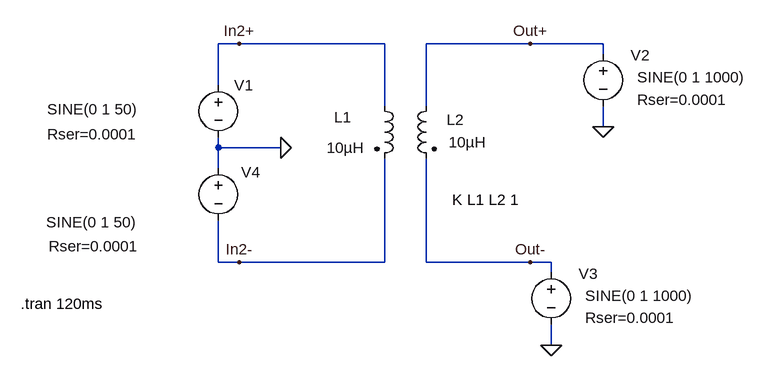
[diagram p0: schematic AC Power Flow ver 1.3.asc]
AC Power Flow ver 1.3.asc, the LTspice schematic file:
Version 4
SHEET 1 880 680
WIRE -704 -96 -736 -96
WIRE -480 -96 -704 -96
WIRE -256 -96 -416 -96
WIRE -144 -96 -256 -96
WIRE -144 -80 -144 -96
WIRE -736 -32 -736 -96
WIRE -480 0 -480 -96
WIRE -416 0 -416 -96
WIRE -144 32 -144 0
WIRE -736 64 -736 48
WIRE -640 64 -736 64
WIRE -736 96 -736 64
WIRE -736 240 -736 176
WIRE -704 240 -736 240
WIRE -480 240 -480 80
WIRE -480 240 -704 240
WIRE -416 240 -416 80
WIRE -256 240 -416 240
WIRE -224 240 -256 240
WIRE -224 256 -224 240
WIRE -224 368 -224 336
FLAG -640 64 0
FLAG -704 -96 In2+
FLAG -704 240 In2-
FLAG -256 -96 Out+
FLAG -256 240 Out-
FLAG -144 32 0
FLAG -224 368 0
SYMBOL voltage -736 -48 R0
WINDOW 3 -263 53 Left 2
WINDOW 123 0 0 Left 2
WINDOW 39 -263 91 Left 2
SYMATTR Value SINE(0 1 50)
SYMATTR SpiceLine Rser=0.0001
SYMATTR InstName V1
SYMBOL voltage -736 80 R0
WINDOW 0 35 22 Left 2
WINDOW 3 -265 99 Left 2
WINDOW 123 0 0 Left 2
WINDOW 39 -261 136 Left 2
SYMATTR InstName V4
SYMATTR Value SINE(0 1 50)
SYMATTR SpiceLine Rser=0.0001
SYMBOL ind2 -496 -16 R0
WINDOW 0 -62 33 Left 2
WINDOW 3 -73 80 Left 2
SYMATTR InstName L1
SYMATTR Value 10µH
SYMATTR Type ind
SYMBOL ind2 -400 -16 M0
WINDOW 0 -42 37 Left 2
WINDOW 3 -76 72 Left 2
SYMATTR InstName L2
SYMATTR Value 10µH
SYMATTR Type ind
SYMBOL voltage -144 -96 R0
WINDOW 3 52 52 Left 2
WINDOW 123 0 0 Left 2
WINDOW 39 52 86 Left 2
WINDOW 0 42 18 Left 2
SYMATTR Value SINE(0 1 1000)
SYMATTR SpiceLine Rser=0.0001
SYMATTR InstName V2
SYMBOL voltage -224 240 R0
WINDOW 3 52 52 Left 2
WINDOW 123 0 0 Left 2
WINDOW 39 52 86 Left 2
WINDOW 0 42 18 Left 2
SYMATTR Value SINE(0 1 1000)
SYMATTR SpiceLine Rser=0.0001
SYMATTR InstName V3
TEXT -1040 304 Left 2 !.tran 120ms
TEXT -376 144 Left 2 !K L1 L2 1

The netlist it stands for:
* AC Power Flow ver 1.3.asc
V1 In2+ 0 SINE(0 1 50) Rser=0.0001
V4 0 In2- SINE(0 1 50) Rser=0.0001
L1 In2+ In2- 10µH
L2 Out+ Out- 10µH
V2 Out+ 0 SINE(0 1 1000) Rser=0.0001
V3 Out- 0 SINE(0 1 1000) Rser=0.0001
.tran 120ms
K L1 L2 1
.backanno
.end